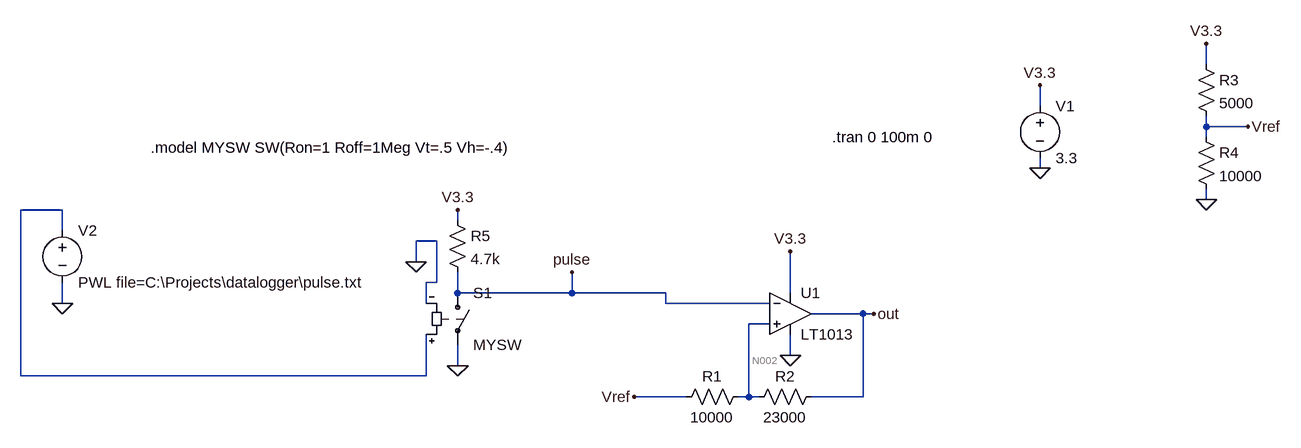
[diagram p0: schematic Draft2.asc]
Draft2.asc, the LTspice schematic file:
Version 4
SHEET 1 960 680
WIRE 832 -224 832 -256
WIRE 576 -160 576 -192
WIRE 832 -128 832 -144
WIRE 896 -128 832 -128
WIRE 832 -112 832 -128
WIRE 576 -64 576 -80
WIRE 832 -16 832 -32
WIRE -928 0 -992 0
WIRE -320 16 -320 0
WIRE -928 32 -928 0
WIRE -352 48 -384 48
WIRE -384 80 -384 48
WIRE -352 112 -352 48
WIRE -352 112 -368 112
WIRE -320 128 -320 96
WIRE -144 128 -144 96
WIRE -144 128 -320 128
WIRE 0 128 -144 128
WIRE 192 128 192 64
WIRE -928 144 -928 112
WIRE -368 144 -368 112
WIRE 0 144 0 128
WIRE 160 144 0 144
WIRE 304 160 224 160
WIRE 320 160 304 160
WIRE 160 176 128 176
WIRE 192 224 192 192
WIRE -320 240 -320 208
WIRE -992 256 -992 0
WIRE -368 256 -368 192
WIRE -368 256 -992 256
WIRE 32 288 -48 288
WIRE 128 288 128 176
WIRE 128 288 112 288
WIRE 144 288 128 288
WIRE 304 288 304 160
WIRE 304 288 224 288
FLAG 192 224 0
FLAG 320 160 out
FLAG 576 -64 0
FLAG 576 -192 V3.3
FLAG 192 64 V3.3
FLAG 832 -16 0
FLAG 896 -128 Vref
FLAG 832 -256 V3.3
FLAG -48 288 Vref
FLAG -320 240 0
FLAG -144 96 pulse
FLAG -320 0 V3.3
FLAG -928 144 0
FLAG -384 80 0
SYMBOL OpAmps\\LT1013 192 96 R0
SYMATTR InstName U1
SYMBOL voltage 576 -176 R0
WINDOW 123 0 0 Left 0
WINDOW 39 0 0 Left 0
SYMATTR InstName V1
SYMATTR Value 3.3
SYMBOL res 128 272 R90
WINDOW 0 0 56 VBottom 2
WINDOW 3 32 56 VTop 2
SYMATTR InstName R1
SYMATTR Value 10000
SYMBOL res 240 272 R90
WINDOW 0 0 56 VBottom 2
WINDOW 3 32 56 VTop 2
SYMATTR InstName R2
SYMATTR Value 23000
SYMBOL res 816 -240 R0
SYMATTR InstName R3
SYMATTR Value 5000
SYMBOL res 816 -128 R0
SYMATTR InstName R4
SYMATTR Value 10000
SYMBOL sw -320 112 R0
SYMATTR InstName S1
SYMATTR Value MYSW
SYMBOL res -336 0 R0
SYMATTR InstName R5
SYMATTR Value 4.7k
SYMBOL voltage -928 16 R0
WINDOW 123 0 0 Left 0
WINDOW 39 0 0 Left 0
SYMATTR InstName V2
SYMATTR Value PWL file=C:\Projects\datalogger\pulse.txt
TEXT 256 -112 Left 2 !.tran 0 100m 0
TEXT -792 -96 Left 2 !.model MYSW SW(Ron=1 Roff=1Meg Vt=.5 Vh=-.4)

The netlist it stands for:
* Draft2.asc
XU1 N002 pulse V3.3 0 out LT1013  ; pins In+ In- V+ V- OUT
V1 V3.3 0 3.3
R1 N002 Vref 10000
R2 out N002 23000
R3 V3.3 Vref 5000
R4 Vref 0 10000
S1 pulse 0 N001 0 MYSW
R5 V3.3 pulse 4.7k
V2 N001 0 PWL file=C:\Projects\datalogger\pulse.txt
.tran 0 100m 0
.model MYSW SW(Ron=1 Roff=1Meg Vt=.5 Vh=-.4)
.lib LTC.lib
.backanno
.end

* Results of the author's LTspice run, read from the files saved beside the schematic
* Operating Point, zero values left out:
*   V(pulse) = 3.285 V
*   V(n002) = 1.4 V
*   V(v3.3) = 3.3 V
*   V(out) = 18.54 mV
*   V(vref) = 2 V
*   I(R5) = 3.289 µA
*   I(R4) = 200 µA
*   I(R3) = 260 µA
*   I(R2) = -60.05 µA
*   I(R1) = -60.03 µA
*   I(S1) = -3.285 µA
*   I(V1) = -376.9 µA
*   Ix(u1:1) = -16.36 nA
*   Ix(u1:2) = 4.497 nA
*   Ix(u1:3) = 113.6 µA
*   Ix(u1:4) = -164 µA
*   Ix(u1:5) = 60.05 µA
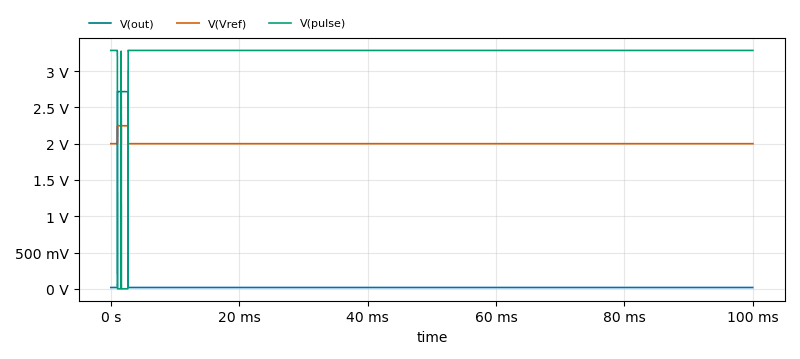
[diagram p1: Transient Analysis of Draft2.asc, plotted from the saved traces]
* Transient Analysis, 1 run:
*   V(out): min 18.54 mV, max 2.718 V, average 62.45 mV, rms 346.6 mV, last 18.54 mV
*   V(Vref): min 2 V, max 2.248 V, average 2.004 V, rms 2.004 V, last 2 V
*   V(pulse): min 702 µV, max 3.285 V, average 3.231 V, rms 3.258 V, last 3.285 V